# Altium schematic sheet Input_stages.SchDoc
size A4
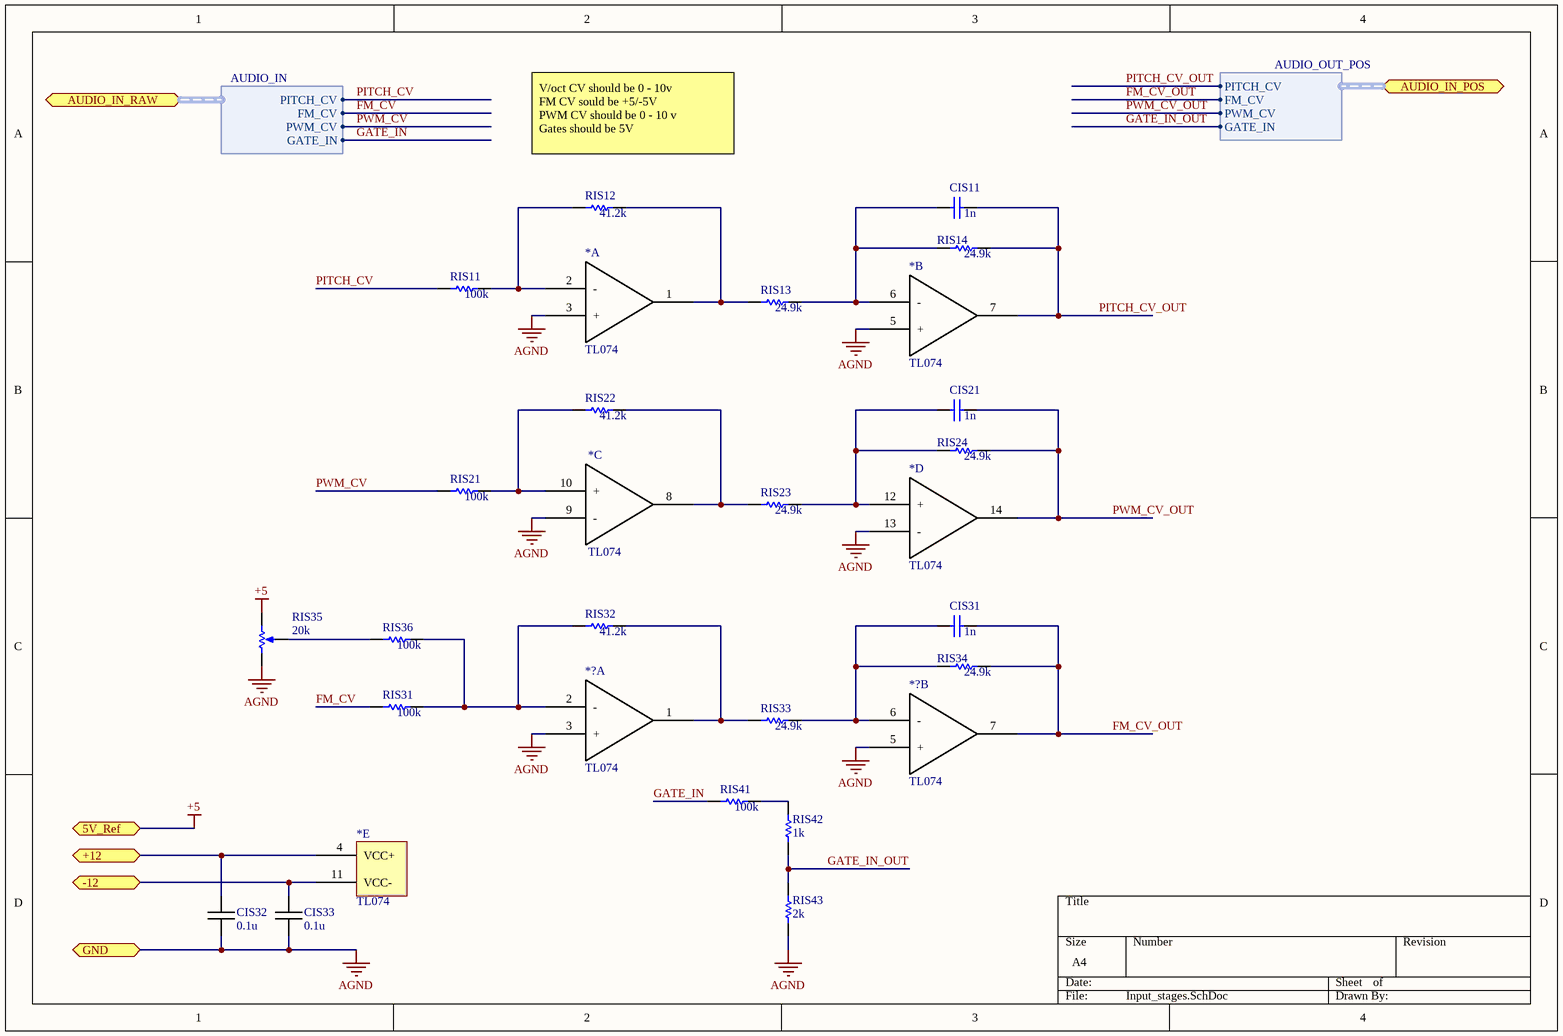
[diagram p0: Input_stages.SchDoc]

## Parts
(Parts that share a designator on the sheet are numbered #1, #2 ... from top to bottom, then left to right.)
*#1  TL074  [DIP-14]  (part A of 5)
*#2  TL074  [DIP-14]  (part B of 5)
*#3  TL074  [DIP-14]  (part C of 5)
*#4  TL074  [DIP-14]  (part D of 5)
*#5  TL074  [DIP-14]  (part E of 5)
*?#1  TL074  [DIP-14]  (part A of 5)
*?#2  TL074  [DIP-14]  (part B of 5)
CIS11  value 1n  [C 0603 / 1608]  (hidden comment: Cap)
CIS21  value 1n  [C 0603 / 1608]  (hidden comment: Cap)
CIS31  value 1n  [C 0603 / 1608]  (hidden comment: Cap)
CIS32  0.1u  [C 0603 / 1608]
CIS33  0.1u  [C 0603 / 1608]
RIS11  value 100k  [RES0603R]  (hidden comment: Res1)
RIS12  value 41.2k  [RES0603R]  (hidden comment: Res1)
RIS13  value 24.9k  [RES0603R]  (hidden comment: Res1)
RIS14  value 24.9k  [RES0603R]  (hidden comment: Res1)
RIS21  value 100k  [RES0603R]  (hidden comment: Res1)
RIS22  value 41.2k  [RES0603R]  (hidden comment: Res1)
RIS23  value 24.9k  [RES0603R]  (hidden comment: Res1)
RIS24  value 24.9k  [RES0603R]  (hidden comment: Res1)
RIS31  value 100k  [RES0603R]  (hidden comment: Res1)
RIS32  value 41.2k  [RES0603R]  (hidden comment: Res1)
RIS33  value 24.9k  [RES0603R]  (hidden comment: Res1)
RIS34  value 24.9k  [RES0603R]  (hidden comment: Res1)
RIS35  value 20k  [SMD_POT_3x3mm]
RIS36  value 100k  [RES0603R]  (hidden comment: Res1)
RIS41  value 100k  [RES0603R]  (hidden comment: Res1)
RIS42  value 1k  [RES0603R]  (hidden comment: Res1)
RIS43  value 2k  [RES0603R]  (hidden comment: Res1)

## Ports
5V_Ref (bidir), +12 (bidir), -12 (bidir), AUDIO_IN_POS (bidir, harness AUDIO_OUT_POS), AUDIO_IN_RAW (bidir, harness AUDIO_IN), GND (bidir)

## Harnesses
AUDIO_IN: PITCH_CV, FM_CV, PWM_CV, GATE_IN
AUDIO_OUT_POS: PITCH_CV, FM_CV, PWM_CV, GATE_IN

## Nets
+5: RIS35.2(BOT) ; port 5V_Ref
AGND: *#1.3(+) *#2.5(+) *#3.9(-) *#4.13(-) *?#1.3(+) *?#2.5(+) CIS32.1 CIS33.1 RIS35.1(TOP) RIS43.1 ; port GND
+12: *#5.4(VCC+) CIS32.2 ; port +12
-12: *#5.11(VCC-) CIS33.2 ; port -12
FM_CV: RIS31.1 ; port AUDIO_IN_RAW.FM_CV
FM_CV_OUT: *?#2.7(OUT) CIS31.2 RIS34.2 ; port AUDIO_IN_POS.FM_CV
GATE_IN: RIS41.1 ; port AUDIO_IN_RAW.GATE_IN
GATE_IN_OUT: RIS42.1 RIS43.2 ; port AUDIO_IN_POS.GATE_IN
PITCH_CV: RIS11.1 ; port AUDIO_IN_RAW.PITCH_CV
PITCH_CV_OUT: *#2.7(OUT) CIS11.2 RIS14.2 ; port AUDIO_IN_POS.PITCH_CV
PWM_CV: RIS21.1 ; port AUDIO_IN_RAW.PWM_CV
PWM_CV_OUT: *#4.14(OUT) CIS21.2 RIS24.2 ; port AUDIO_IN_POS.PWM_CV
Net*#1_1: *#1.1(OUT) RIS12.2 RIS13.1
Net*#1_2: *#1.2(-) RIS11.2 RIS12.1
Net*#2_6: *#2.6(-) CIS11.1 RIS13.2 RIS14.1
Net*#3_8: *#3.8(OUT) RIS22.2 RIS23.1
Net*#3_10: *#3.10(+) RIS21.2 RIS22.1
Net*#4_12: *#4.12(+) CIS21.1 RIS23.2 RIS24.1
Net*?#1_1: *?#1.1(OUT) RIS32.2 RIS33.1
Net*?#1_2: *?#1.2(-) RIS31.2 RIS32.1 RIS36.2
Net*?#2_6: *?#2.6(-) CIS31.1 RIS33.2 RIS34.1
NetRIS35_3: RIS35.3(TAP) RIS36.1
NetRIS41_2: RIS41.2 RIS42.2

## Notes on the sheet
- V/oct CV should be 0 - 10v
  FM CV sould be +5/-5V
  PWM CV should be 0 - 10 v
  Gates should be 5V

## Library data of the parts
CIS11 CIS21 CIS31 = Cap: Capacitor; Published: 8-Jun-2000; LatestRevisionDate: 17-Jul-2002; LatestRevisionNote: Re-released for DXP Platform.; PackageReference: RAD-0.3; Publisher: Altium Limited; PackageDescription: Radial Cap, Thru-Hole; 2 Leads; 0.3 in Pin Spacing
CIS32 CIS33 = Capacitor: Value: asdasd
RIS11-RIS14 RIS21-RIS24 RIS31-RIS34 RIS36 RIS41-RIS43 = Res1: Resistor; Published: 8-Jun-2000; LatestRevisionDate: 17-Jul-2002; LatestRevisionNote: Re-released for DXP Platform.; PackageReference: AXIAL-0.3; Publisher: Altium Limited; PackageDescription: Axial Device, Thru-Hole; 2 Leads; 0.3 in Pin Spacing
RIS35 = RPot: Potentiometer; Sim Note: Enter the Resistance value and the set point into parameter fields.; Set Position: 0.5; Published: 8-Jun-2000; LatestRevisionDate: 17-Jul-2002; LatestRevisionNote: Re-released for DXP Platform.; PackageReference: VR5; Publisher: Altium Limited; PackageDescription: Variable Resistor, Thru-Hole; 3 Leads